# EAGLE design CommsBoard (EAGLE 7.2.0)
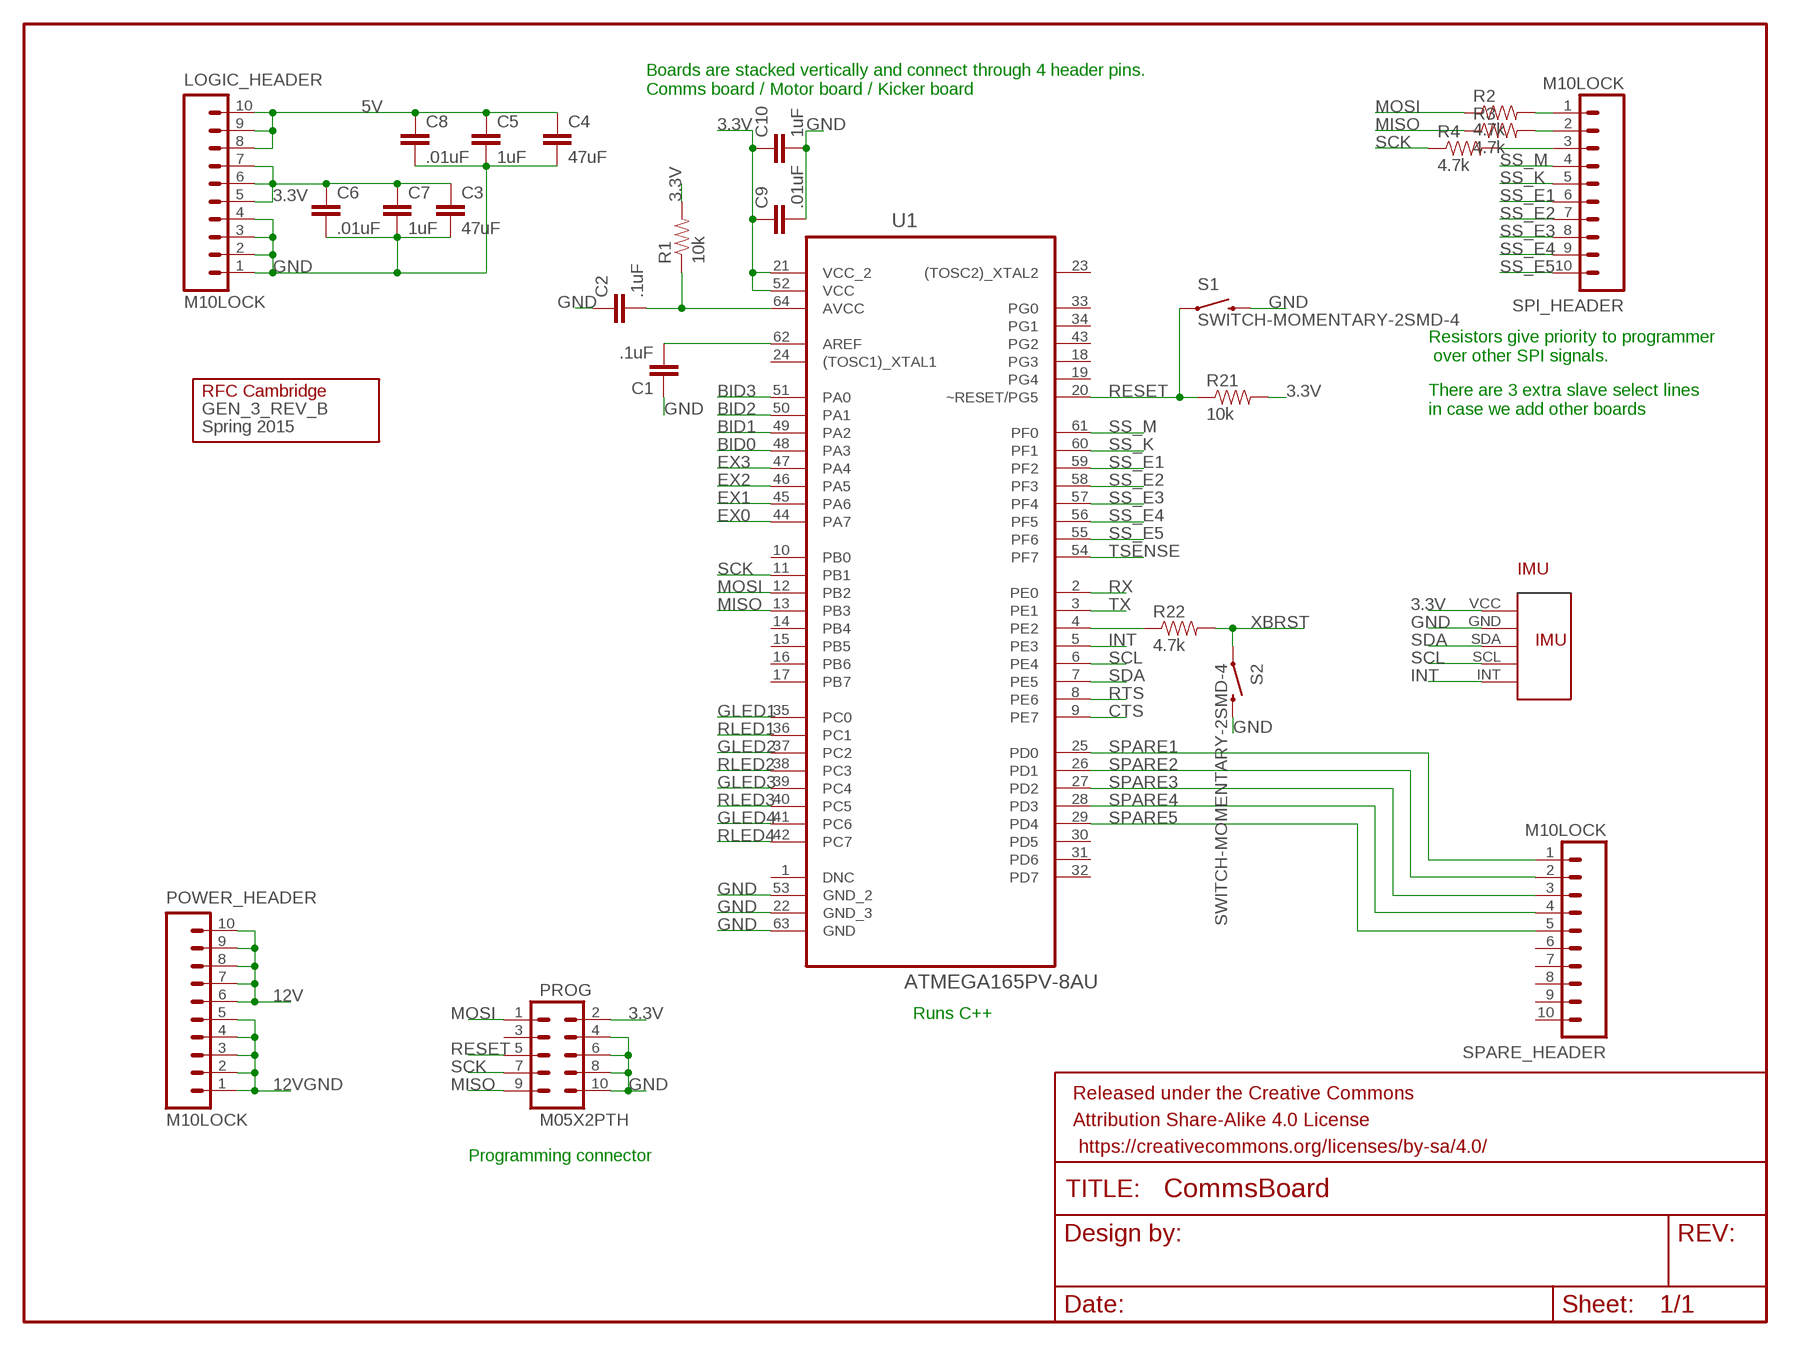
[diagram p0: schematic, sheet 1, part 1 of 2]
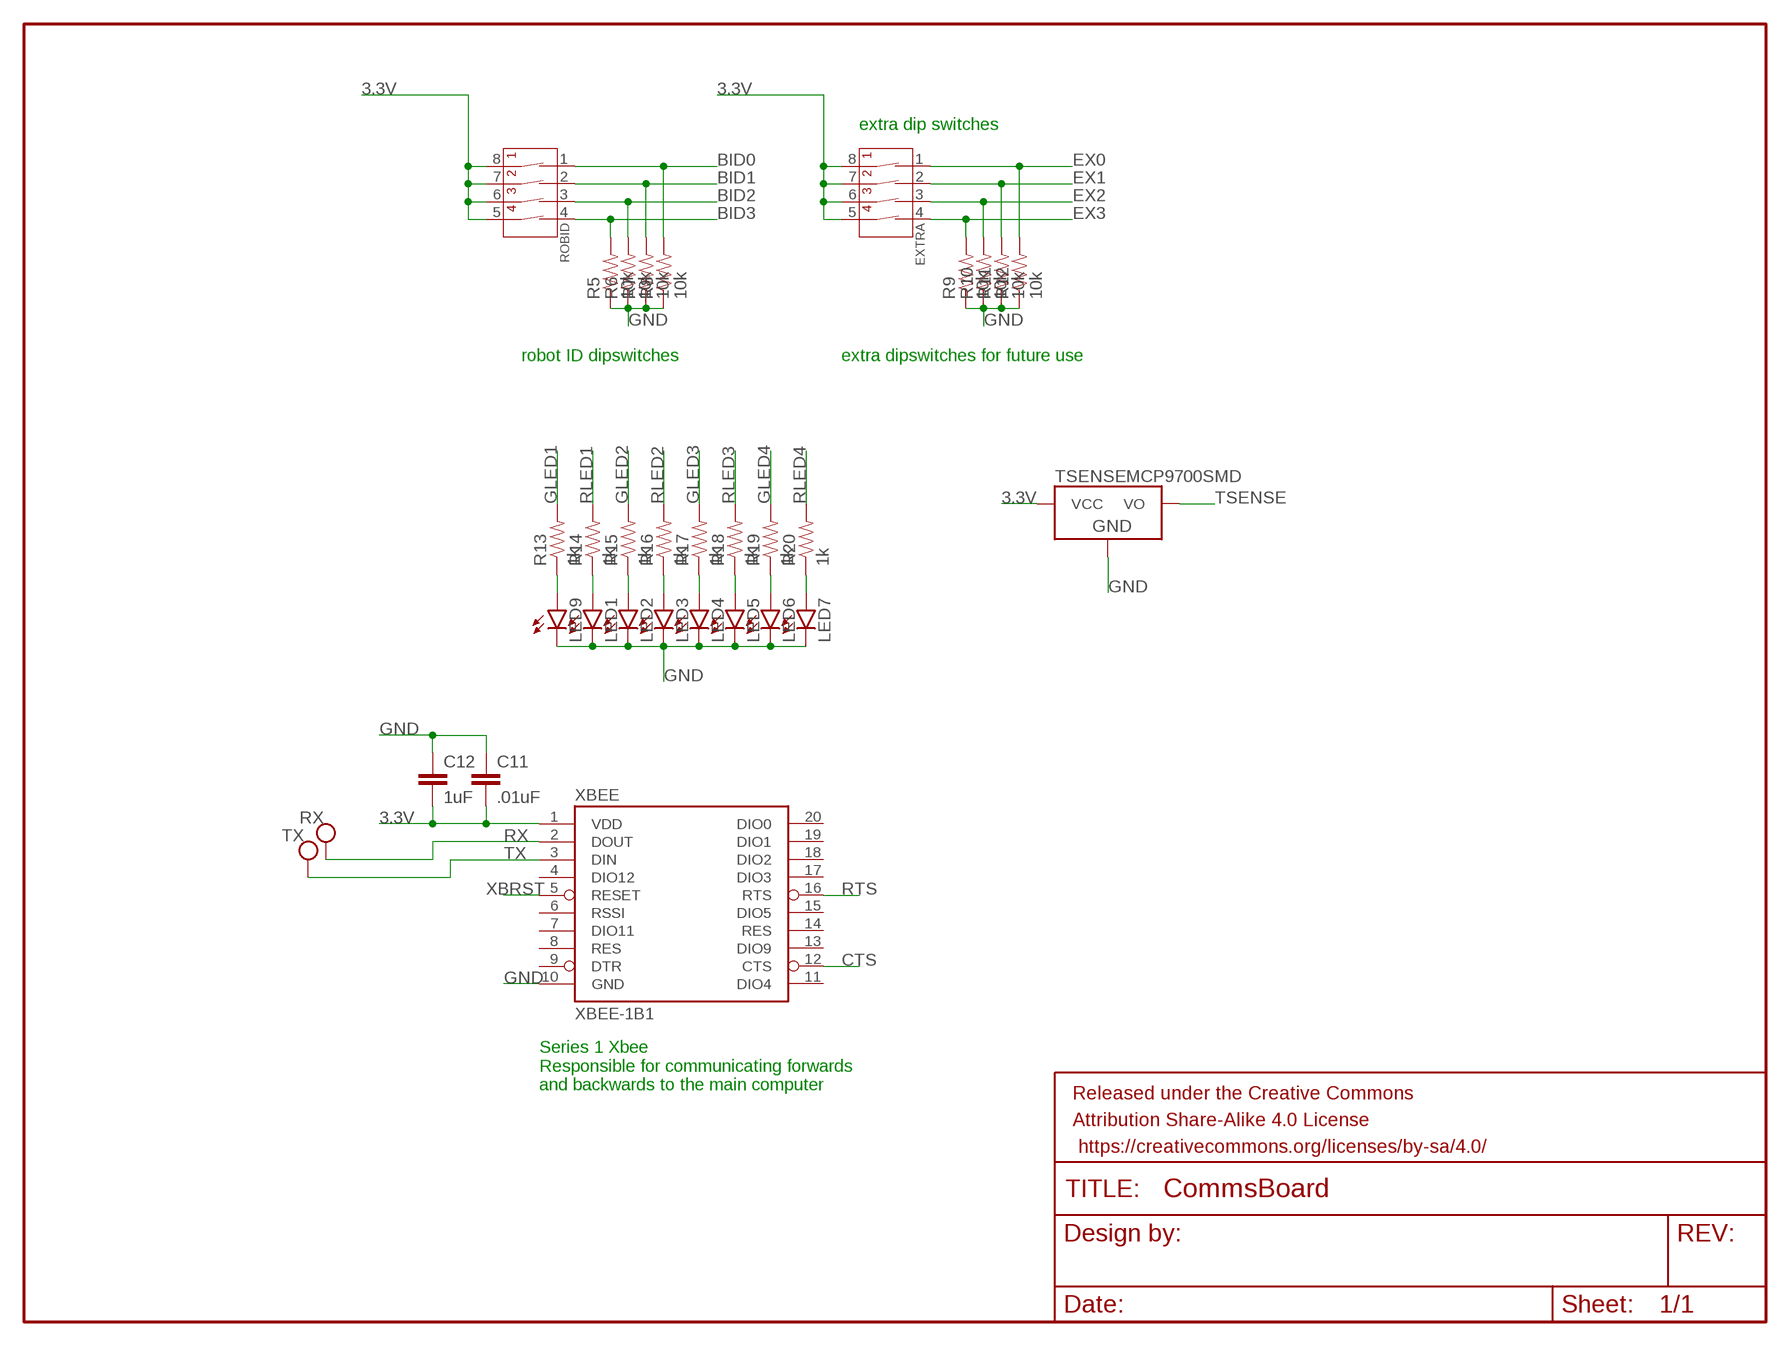
[diagram p1: schematic, sheet 1, part 2 of 2]

## Parts
C1  .1uF  CAP0805  [0805]
C2  .1uF  CAP0805  [0805]
C3  47uF  CAP1206  [1206]
C4  47uF  CAP1206  [1206]
C5  1uF  CAP0805  [0805]
C6  .01uF  CAP0805  [0805]
C7  1uF  CAP0805  [0805]
C8  .01uF  CAP0805  [0805]
C9  .01uF  CAP0805  [0805]
C10  1uF  CAP0805  [0805]
C11  .01uF  CAP0805  [0805]
C12  1uF  CAP0805  [0805]
EXTRA  4-POS-DIP  [4-POS-DIP-SMD]
FRAME1  FRAME-LETTER  [CREATIVE_COMMONS]
FRAME2  FRAME-LETTER  [CREATIVE_COMMONS]
GEN_3_REV_B  Spring 2015  LOGO  [LOGO]
IMU  MPU6050IMUMPU  [MPU-6050IMU]
LED1  LED1206  [LED-1206]
LED2  LED1206  [LED-1206]
LED3  LED1206  [LED-1206]
LED4  LED1206  [LED-1206]
LED5  LED1206  [LED-1206]
LED6  LED1206  [LED-1206]
LED7  LED1206  [LED-1206]
LED9  LED1206  [LED-1206]
LOGIC_HEADER  M10LOCK  [1X10_LOCK]
POWER_HEADER  M10LOCK  [1X10_LOCK]
PROG  M05X2PTH  [AVR_ICSP]
R1  10k  RESISTOR0805-RES  [0805]
R2  4.7k  RESISTOR0805-RES  [0805]
R3  4.7k  RESISTOR0805-RES  [0805]
R4  4.7k  RESISTOR0805-RES  [0805]
R5  10k  RESISTOR0805-RES  [0805]
R6  10k  RESISTOR0805-RES  [0805]
R7  10k  RESISTOR0805-RES  [0805]
R8  10k  RESISTOR0805-RES  [0805]
R9  10k  RESISTOR0805-RES  [0805]
R10  10k  RESISTOR0805-RES  [0805]
R11  10k  RESISTOR0805-RES  [0805]
R12  10k  RESISTOR0805-RES  [0805]
R13  1k  RESISTOR0805-RES  [0805]
R14  1k  RESISTOR0805-RES  [0805]
R15  1k  RESISTOR0805-RES  [0805]
R16  1k  RESISTOR0805-RES  [0805]
R17  1k  RESISTOR0805-RES  [0805]
R18  1k  RESISTOR0805-RES  [0805]
R19  1k  RESISTOR0805-RES  [0805]
R20  1k  RESISTOR0805-RES  [0805]
R21  10k  RESISTOR0805-RES  [0805]
R22  4.7k  RESISTOR0805-RES  [0805]
ROBID  4-POS-DIP  [4-POS-DIP-SMD]
RX  TEST_PT  [TESTING_PT]
S1  SWITCH-MOMENTARY-2SMD-4  [TACTILE_SWITCH_TALL]
S2  SWITCH-MOMENTARY-2SMD-4  [TACTILE_SWITCH_TALL]
SPARE_HEADER  M10LOCK  [1X10_LOCK]
SPI_HEADER  M10LOCK  [1X10_LOCK]
TSENSE  MCP9700SMD  [SOT23-3]
TX  TEST_PT  [TESTING_PT]
U1  ATMEGA165PV-8AU  [QFP80P1600X1600X120-64N]
XBEE  XBEE-1B1  [XBEE-1]

## Nets
3.3V: C3.1 C6.1 C7.1 C9.1 C10.1 C11.2 C12.2 EXTRA.5(4B) EXTRA.6(3B) EXTRA.7(2B) EXTRA.8(1B) IMU.VCC LOGIC_HEADER.5 LOGIC_HEADER.6 LOGIC_HEADER.7 PROG.2 R1.2 R21.2 ROBID.5(4B) ROBID.6(3B) ROBID.7(2B) ROBID.8(1B) TSENSE.1(VCC) U1.21(VCC_2) U1.52(VCC) XBEE.1(VDD)
5V: C4.1 C5.1 C8.1 LOGIC_HEADER.8 LOGIC_HEADER.9 LOGIC_HEADER.10
12V: POWER_HEADER.6 POWER_HEADER.7 POWER_HEADER.8 POWER_HEADER.9 POWER_HEADER.10
12VGND: POWER_HEADER.1 POWER_HEADER.2 POWER_HEADER.3 POWER_HEADER.4 POWER_HEADER.5
BID0: R8.2 ROBID.1(1A) U1.48(PA3)
BID1: R7.2 ROBID.2(2A) U1.49(PA2)
BID2: R6.2 ROBID.3(3A) U1.50(PA1)
BID3: R5.2 ROBID.4(4A) U1.51(PA0)
CTS: U1.9(PE7) XBEE.12(CTS)
EX0: EXTRA.1(1A) R12.2 U1.44(PA7)
EX1: EXTRA.2(2A) R11.2 U1.45(PA6)
EX2: EXTRA.3(3A) R10.2 U1.46(PA5)
EX3: EXTRA.4(4A) R9.2 U1.47(PA4)
FILT: C2.2 R1.1 U1.64(AVCC)
GLED1: R13.2 U1.35(PC0)
GLED2: R15.2 U1.37(PC2)
GLED3: R17.2 U1.39(PC4)
GLED4: R19.2 U1.41(PC6)
GND: C1.1 C2.1 C3.2 C4.2 C5.2 C6.2 C7.2 C8.2 C9.2 C10.2 C11.1 C12.1 IMU.GND LED1.C LED2.C LED3.C LED4.C LED5.C LED6.C LED7.C LED9.C LOGIC_HEADER.1 LOGIC_HEADER.2 LOGIC_HEADER.3 LOGIC_HEADER.4 PROG.4 PROG.6 PROG.8 PROG.10 R5.1 R6.1 R7.1 R8.1 R9.1 R10.1 R11.1 R12.1 S1.B2 S2.B2 TSENSE.3(GND) U1.22(GND_3) U1.53(GND_2) U1.63(GND) XBEE.10(GND)
INT: IMU.INT U1.5(PE3)
MISO: PROG.9 R3.1 U1.13(PB3)
MOSI: PROG.1 R2.1 U1.12(PB2)
N$1: LED9.A R13.1
N$2: R22.1 U1.4(PE2)
N$5: LED1.A R14.1
N$6: LED2.A R15.1
N$7: LED3.A R16.1
N$8: LED4.A R17.1
N$9: LED5.A R18.1
N$10: LED6.A R19.1
N$11: LED7.A R20.1
N$17: C1.2 U1.62(AREF)
PRE-MISO: R3.2 SPI_HEADER.2
PRE-MOSI: R2.2 SPI_HEADER.1
PRE-SCK: R4.2 SPI_HEADER.3
RESET: PROG.5 R21.1 S1.A2 U1.20(~RESET/PG5)
RLED1: R14.2 U1.36(PC1)
RLED2: R16.2 U1.38(PC3)
RLED3: R18.2 U1.40(PC5)
RLED4: R20.2 U1.42(PC7)
RTS: U1.8(PE6) XBEE.16(RTS)
RX: RX.P$1 U1.2(PE0) XBEE.2(DOUT)
SCK: PROG.7 R4.1 U1.11(PB1)
SCL: IMU.SCL U1.6(PE4)
SDA: IMU.SDA U1.7(PE5)
SPARE1: SPARE_HEADER.1 U1.25(PD0)
SPARE2: SPARE_HEADER.2 U1.26(PD1)
SPARE3: SPARE_HEADER.3 U1.27(PD2)
SPARE4: SPARE_HEADER.4 U1.28(PD3)
SPARE5: SPARE_HEADER.5 U1.29(PD4)
SS_E1: SPI_HEADER.6 U1.59(PF2)
SS_E2: SPI_HEADER.7 U1.58(PF3)
SS_E3: SPI_HEADER.8 U1.57(PF4)
SS_E4: SPI_HEADER.9 U1.56(PF5)
SS_E5: SPI_HEADER.10 U1.55(PF6)
SS_K: SPI_HEADER.5 U1.60(PF1)
SS_M: SPI_HEADER.4 U1.61(PF0)
TSENSE: TSENSE.2(VO) U1.54(PF7)
TX: TX.P$1 U1.3(PE1) XBEE.3(DIN)
XBRST: R22.2 S2.A2 XBEE.5(RESET)
Unconnected: PROG.3 SPARE_HEADER.6 SPARE_HEADER.7 SPARE_HEADER.8 SPARE_HEADER.9 SPARE_HEADER.10 U1.1(DNC) U1.10(PB0) U1.14(PB4) U1.15(PB5) U1.16(PB6) U1.17(PB7) U1.18(PG3) U1.19(PG4) U1.23((TOSC2)_XTAL2) U1.24((TOSC1)_XTAL1) U1.30(PD5) U1.31(PD6) U1.32(PD7) U1.33(PG0) U1.34(PG1) U1.43(PG2) XBEE.4(DIO12) XBEE.6(RSSI) XBEE.7(DIO11) XBEE.8(RES) XBEE.9(DTR) XBEE.11(DIO4) XBEE.13(DIO9) XBEE.14(RES) XBEE.15(DIO5) XBEE.17(DIO3) XBEE.18(DIO2) XBEE.19(DIO1) XBEE.20(DIO0)

## Notes on the sheet
- Boards are stacked vertically and connect through 4 header pins.
  Comms board / Motor board / Kicker board
- extra dip switches
- Resistors give priority to programmer
   over other SPI signals.
- robot ID dipswitches | extra dipswitches for future use
- There are 3 extra slave select lines
  in case we add other boards
- Runs C++
- Series 1 Xbee
  Responsible for communicating forwards
  and backwards to the main computer
- Programming connector

## Library data of the parts
C1-C12 = SparkFun-Capacitors:CAP: Capacitor Standard 0603 ceramic capacitor, and 0.1" leaded capacitor.
EXTRA ROBID = SparkFun-Electromechanical:4-POS-DIP: 4 Position DIP Switch CTS series 219; PROD_ID: SWCH-12418
FRAME1 FRAME2 = SparkFun-Aesthetics:FRAME-LETTER: Schematic Frame Standard 8.5x11 US Letter frame
GEN_3_REV_B = gen3:LOGO
IMU = gen3:MPU6050IMU: MPU6050 IMU
LED1-LED7 LED9 = SparkFun-LED:LED: LEDs Standard schematic elements and footprints for 5mm, 3mm, 1206, and 0603 sized LEDs. 5mm - Spark Fun Electronics SKU : COM-00529 (and others)
LOGIC_HEADER POWER_HEADER SPARE_HEADER SPI_HEADER = SparkFun-Connectors:M10: Header 10 Standard 10-pin 0.1" header. Use with straight break away headers (SKU : PRT-00116), right angle break away headers (PRT-00553), swiss pins (PRT-00743), machine pins (PRT-00117), and female headers (PRT-00115).
PROG = SparkFun-Connectors:M05X2: Header 5x2 Standard 10-pin dual row 0.1" header. Commonly used with AVR-ISP. Use with Spark Fun Electronics SKU: PRT-00778
R1-R22 = SparkFun-Passives:RESISTOR: Resistor Basic schematic elements and footprints for 0603, 1206, and PTH resistors.
RX TX = gen3:TEST_PT: Testing Point Use to probe a signal
S1 S2 = SparkFun-Electromechanical:SWITCH-MOMENTARY-2: Various NO switches- pushbuttons, reed, etc; PROD_ID: SWCH-11966
TSENSE = SparkFun-Sensors:MCP9700: Analog-output temperature sensor; PROD_ID: IC-08917
U1 = gen3:ATMEGA165PV-8AU: 8-bit Microcontroller with 16K Bytes In-System Programmable Flash; MPN: ATMEGA165PV-8AU; OC_FARNELL: 1455104; OC_NEWARK: 58M3730; PACKAGE: TQFP-64; SUPPLIER: Atmel
XBEE = SparkFun-RF:XBEE-1: Xbee module footprints SMT header is CONN-09042.

## Board
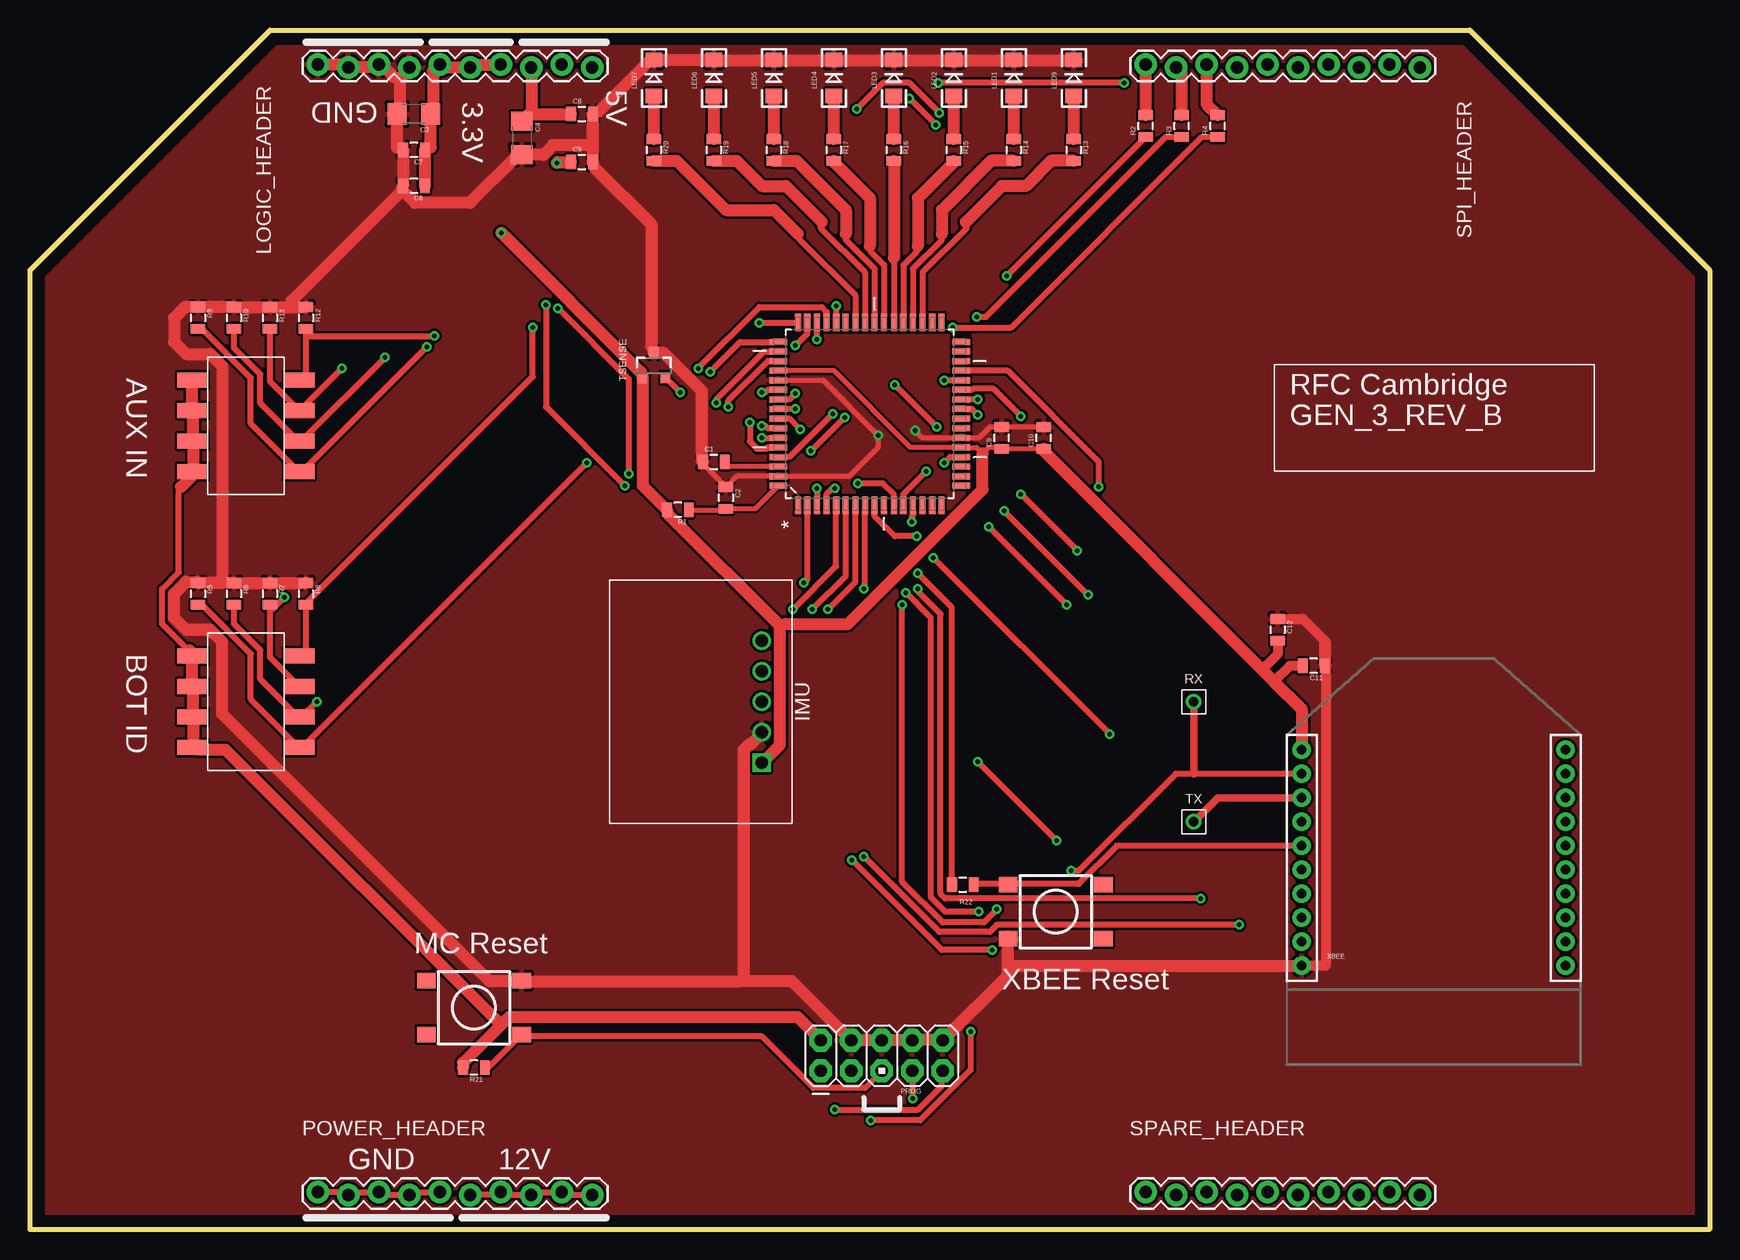
[diagram p2: board, top side]
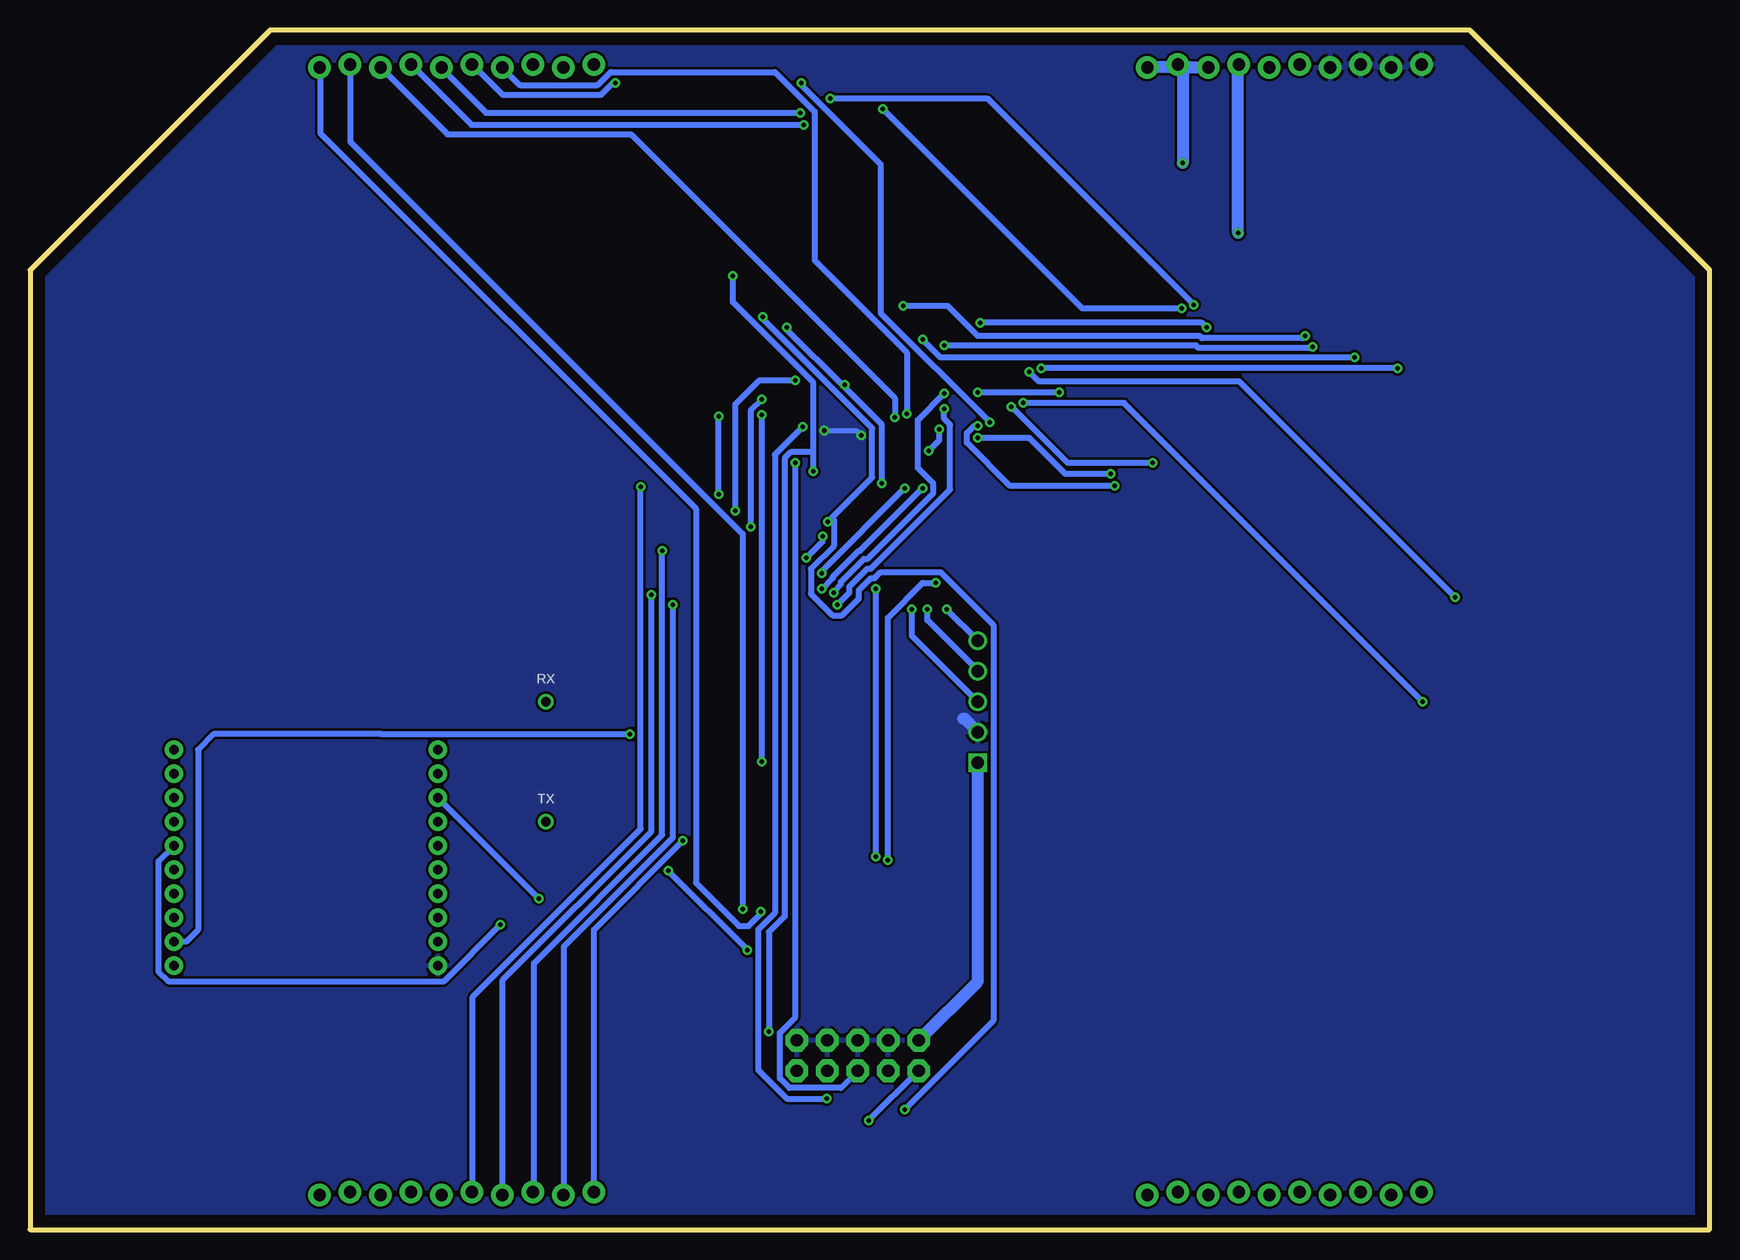
[diagram p3: board, bottom side, seen from below]

Size 140 x 100 mm. Coordinates in mm from the lower left corner, seen from the top.
Outline: 0,0 0,80 20,100 120,100 140,80 140,0 0,0
Copper layers (1*16): Top 0.035mm / dielectric 1.5mm / Bottom 0.035mm
Design rules "default *": minimum track width 10mil, minimum drill 15mil, track to track 8mil, track to pad 8mil, pad to pad 8mil, via to via 8mil, smd to smd 8mil, copper to edge 40mil, drill to drill 8mil, minimum pad ring 10mil, minimum via ring 8mil, stop-mask expansion 4mil, vias tented up to drill 0mil, thermal gap 10mil

### Footprints (pad centres in the part's own frame; a part is rotated, then mirrored left to right if it is on the bottom)
0805 = smd 0.8 x 1.2: 1 -0.9,0; 2 0.9,0
1206 = smd 1.6 x 1.8: 1 -1.4,0; 2 1.4,0
4-POS-DIP-SMD = smd 1.27 x 2.54: 1 -3.81,4.445; 2 -1.27,4.445; 3 1.27,4.445; 4 3.81,4.445; 5 3.81,-4.445; 6 1.27,-4.445; 7 -1.27,-4.445; 8 -3.81,-4.445
MPU-6050IMU = drill 1.016: GND 0,-2.54; INT 0,5.08; SCL 0,2.54; SDA 0,0 | drill 1.016 square: VCC 0,-5.08
LED-1206 = smd 1.2 x 1.4: A -1.5,0; C 1.5,0
1X10_LOCK = drill 1.016 pad 1.88: 1 0,0.127; 2 2.54,-0.127; 3 5.08,0.127; 4 7.62,-0.127; 5 10.16,0.127; 6 12.7,-0.127; 7 15.24,0.127; 8 17.78,-0.127; 9 20.32,0.127; 10 22.86,-0.127
AVR_ICSP = drill 1.016 pad 1.88 octagon: 1 -1.27,5.08; 2 1.27,5.08; 3 -1.27,2.54; 4 1.27,2.54; 5 -1.27,0; 6 1.27,0; 7 -1.27,-2.54; 8 1.27,-2.54; 9 -1.27,-5.08; 10 1.27,-5.08
TESTING_PT = drill 0.8: P$1 0,0
TACTILE_SWITCH_TALL = smd 1.55 x 1.3: A1 -3.975,-2.25; A2 3.975,-2.25; B1 -3.975,2.25; B2 3.975,2.25
SOT23-3 = smd 0.8 x 0.9: 1 -0.95,-1; 2 0.95,-1; 3 0,1.1
QFP80P1600X1600X120-64N = smd 1.473 x 0.508: 1 -7.62,5.994; 2 -7.62,5.207; 3 -7.62,4.394; 4 -7.62,3.607; 5 -7.62,2.794; 6 -7.62,2.007; 7 -7.62,1.194; 8 -7.62,0.406; 9 -7.62,-0.406; 10 -7.62,-1.194; 11 -7.62,-2.007; 12 -7.62,-2.794; 13 -7.62,-3.607; 14 -7.62,-4.394; 15 -7.62,-5.207; 16 -7.62,-5.994; 33 7.62,-5.994; 34 7.62,-5.207; 35 7.62,-4.394; 36 7.62,-3.607; 37 7.62,-2.794; 38 7.62,-2.007; 39 7.62,-1.194; 40 7.62,-0.406; 41 7.62,0.406; 42 7.62,1.194; 43 7.62,2.007; 44 7.62,2.794; 45 7.62,3.607; 46 7.62,4.394; 47 7.62,5.207; 48 7.62,5.994 | smd 0.508 x 1.473: 17 -5.994,-7.62; 18 -5.207,-7.62; 19 -4.394,-7.62; 20 -3.607,-7.62; 21 -2.794,-7.62; 22 -2.007,-7.62; 23 -1.194,-7.62; 24 -0.406,-7.62; 25 0.406,-7.62; 26 1.194,-7.62; 27 2.007,-7.62; 28 2.794,-7.62; 29 3.607,-7.62; 30 4.394,-7.62; 31 5.207,-7.62; 32 5.994,-7.62; 49 5.994,7.62; 50 5.207,7.62; 51 4.394,7.62; 52 3.607,7.62; 53 2.794,7.62; 54 2.007,7.62; 55 1.194,7.62; 56 0.406,7.62; 57 -0.406,7.62; 58 -1.194,7.62; 59 -2.007,7.62; 60 -2.794,7.62; 61 -3.607,7.62; 62 -4.394,7.62; 63 -5.207,7.62; 64 -5.994,7.62
XBEE-1 = drill 0.8 pad 1.524: 1 -11,20; 2 -11,18; 3 -11,16; 4 -11,14; 5 -11,12; 6 -11,10; 7 -11,8; 8 -11,6; 9 -11,4; 10 -11,2; 11 11,2; 12 11,4; 13 11,6; 14 11,8; 15 11,10; 16 11,12; 17 11,14; 18 11,16; 19 11,18; 20 11,20

### Placement (x,y rotation side)
C1  57,64 0 top
C2  58,61 270 top
C3  32,93 180 top
C4  41,91 270 top
C5  46,89 0 top
C6  32,87 180 top
C7  32,90 180 top
C8  46,93 0 top
C9  81,66 90 top
C10  84.5,66 90 top
C11  107,47 180 top
C12  104,50 270 top
EXTRA  18,67 270 top
FRAME1  21.59,-7.62 0 top  (outside the outline)
FRAME2  88.95,-14.47 0 top  (outside the outline)
GEN_3_REV_B  105,64.5 0 top
IMU  61,44 0 top
LED1  82,96 90 top
LED2  77,96 90 top
LED3  72,96 90 top
LED4  67,96 90 top
LED5  62,96 90 top
LED6  57,96 90 top
LED7  52,96 90 top
LED9  87,96 90 top
LOGIC_HEADER  24,97 0 top
POWER_HEADER  24,3 0 top
PROG  71,14.5 90 top
R1  54,60 180 top
R2  93,92 90 top
R3  96,92 90 top
R4  99,92 90 top
R5  14,53 270 top
R6  17,53 270 top
R7  20,53 270 top
R8  23,53 270 top
R9  14,76 270 top
R10  17,76 270 top
R11  20,76 270 top
R12  23,76 270 top
R13  87,90 270 top
R14  82,90 270 top
R15  77,90 270 top
R16  72,90 270 top
R17  67,90 270 top
R18  62,90 270 top
R19  57,90 270 top
R20  52,90 270 top
R21  37,13.5 180 top
R22  77.75,28.75 0 top
ROBID  18,44 270 top
RX  97,44 0 top
S1  37,18.5 0 top
S2  85.5,26.5 180 top
SPARE_HEADER  93,3 0 top
SPI_HEADER  93,97 0 top
TSENSE  52,72 0 top
TX  97,34 0 top
U1  70,68 90 top
XBEE  117,20 0 top

### Tracks (layer width: path | path; a pad name or v marks a point on that pad's centre or on a via)
3.3V  (via drill 0.38)
  Top 0.406: U1.52 67,71.6 73.39,65.21 U1.21 78.9,65.21 79.4,64.71 79.9,65.21 80.89,65.21 C9.1 C10.1
  Top 0.508: 12.6,61.9 12.4,61.4 12.4,54.8 11,53.4 11,50.5 12.9,48.6 13.3,48.3
  Top 0.813: C12.2 104,48 103,47 102.7,46.7 | C11.2 105,47 103.7,45.7
  Top 1.016: XBEE.1 106,43.4 103.7,45.7 102.7,46.7 84.5,64.9 C10.1 | EXTRA.8 13.5,70.8 13.5,68.8 EXTRA.7 13.6,68.2 13.6,66.2 EXTRA.6 13.6,65.7 13.6,63.2 EXTRA.5 13.4,62.7 12.6,61.9 | 13.3,48.3 ROBID.8 13.5,47.8 13.5,45.8 ROBID.7 13.6,45.2 13.6,43.2 ROBID.6 13.6,42.7 13.6,40.2 ROBID.5 14.1,40 16.3,40 39.25,17.05 | C6.1 C7.1 33.4,90.2 C3.1 33.6,93.5 33.6,96.6 34.1,97.1 LOGIC_HEADER.5 34.6,96.9 36.7,96.9 LOGIC_HEADER.6 37.2,97.1 39.2,97.1 LOGIC_HEADER.7 | 51.1,71 51.1,62 R1.2 53.3,59.5 62.5,50.3 | 51.1,71 TSENSE.1 | R21.2 36.1,13.9 39.25,17.05 | 39.25,17.05 39.9,17.7 64,17.7 65.9,15.8 PROG.2 | 62.5,50.3 62.5,40.4 61,38.9 IMU.VCC | v39.3,83.1 50.9,71.5 51.1,71 | 79.4,64.71 79.4,61.7 68.2,50.5 63,50.5 62.5,50.3
  Bottom 1.016: IMU.VCC 61,20.7 65.9,15.8 PROG.2 | v39.3,83.1 39.3,97.1 LOGIC_HEADER.7
5V  (via drill 0.38)
  Top 1.016: 41.8,93 41.6,93 C4.1 | 41.8,93 C8.1 | 41.8,93 41.8,96.8 LOGIC_HEADER.8 | C5.1 44,89 v43.9,88.9
  Bottom 1.016: v43.9,88.9 43.9,96.7 44.3,97.1 LOGIC_HEADER.9 | LOGIC_HEADER.10 46.8,96.9 44.8,96.9 LOGIC_HEADER.9 | LOGIC_HEADER.8 41.8,96.9 43.4,96.9 LOGIC_HEADER.9
12V
  Top 0.508: POWER_HEADER.6 36.7,2.9 39,2.9 39.2,3.1 POWER_HEADER.7 39.3,2.9 41.7,2.9 POWER_HEADER.8 41.9,3.1 44.3,3.1 POWER_HEADER.9 44.4,2.9 46.8,2.9 POWER_HEADER.10
12VGND
  Top 0.508: POWER_HEADER.1 24,3.1 26.3,3.1 26.5,2.9 POWER_HEADER.2 26.6,3.1 29,3.1 POWER_HEADER.3 29.2,2.9 31.6,2.9 POWER_HEADER.4 31.7,3.1 34.1,3.1 POWER_HEADER.5
BID0  (via drill 0.38)
  Top 0.508: ROBID.1 22.5,47.9 23,48.4 R8.2 23.1,52.3 41.9,71.1 v41.9,75.2 | v60.8,75.6 64,75.6 U1.48
  Bottom 0.508: v60.8,75.6 42.3,75.6 v41.9,75.2
BID1  (via drill 0.38)
  Top 0.508: 20,51.7 20,47.7 22.4,45.3 ROBID.2 | 20,51.7 R7.2 | v56.7,71.5 59.2,74 62.3,74 U1.49 | v21.2,52.7 20.2,51.7 20,51.7
  Bottom 0.508: v56.7,71.5 55.9,70.7 39.2,70.7 v21.2,52.7
BID2  (via drill 0.38)
  Top 0.508: R6.2 17,50.5 19.2,48.3 19.2,45.9 22.4,42.7 ROBID.3 22.7,42.8 v23.9,44 | v57.2,68.9 57.2,69.2 61.2,73.2 62.3,73.2 U1.50
  Bottom 0.508: v57.2,68.9 48.8,68.9 v23.9,44
BID3  (via drill 0.38)
  Top 0.508: R5.2 14.3,52.1 18.4,48 18.4,44.2 22.4,40.2 ROBID.4 22.7,40.2 v46.4,63.9 | v58.2,68.6 58.2,69.1 61.5,72.4 62.3,72.4 U1.51
  Bottom 0.508: v58.2,68.6 53.5,63.9 v46.4,63.9
CTS  (via drill 0.38)
  Top 0.508: v73.9,57.8 72.1,57.8 70.4,59.5 70.4,60.3 U1.9 | v90,41.3 v75.3,56
  Bottom 0.5: 110.7,41.3 124.7,41.3 126,40 126,25 127,24 XBEE.12
  Bottom 0.508: v73.9,57.8 73.9,57.4 v75.3,56 | 110.7,41.3 v90,41.3
EX0  (via drill 0.38)
  Top 0.508: 23,74.5 23,71.4 22.5,70.9 EXTRA.1 | 23,74.5 R12.2 | v67.2,77 67.2,75.7 U1.44 | 23,74.5 v33.7,74.5
  Bottom 0.508: v67.2,77 63.5,77 61,74.5 42.5,74.5 42.3,74.3 33.9,74.3 v33.7,74.5
EX1  (via drill 0.38)
  Top 0.508: R11.2 20,70.7 22.4,68.3 EXTRA.2 22.6,68.4 v26,71.8 | v55.7,71.8 60.8,76.9 66,76.9 66.4,76.5 66.4,75.7 U1.45
  Bottom 0.508: v26,71.8 v55.7,71.8
EX2  (via drill 0.38)
  Top 0.508: R10.2 17,73.5 19.2,71.3 19.2,68.9 22.4,65.7 EXTRA.3 22.7,65.8 v29.6,72.7 | v65.6,74.2 65.6,75.6 U1.46
  Bottom 0.508: v65.6,74.2 64.1,72.7 v29.6,72.7
EX3  (via drill 0.38)
  Top 0.508: R9.2 14.3,75.1 18.4,71 18.4,67.2 22.4,63.2 EXTRA.4 22.7,63.2 v33.1,73.6 | v63.8,73.7 64.8,74.7 64.8,75.6 U1.47
  Bottom 0.508: v63.8,73.7 42.8,73.7 42.6,73.5 33.2,73.5 v33.1,73.6
FILT
  Top 0.4: U1.64 60.47,60.1 C2.2 57.9,60 R1.1
GLED1
  Top 0.508: U1.35 74.4,75.7 74.4,79.8 78.1,83.5 78,84
  Top 1.016: R13.2 85.1,89.1 83,87 81,87 78,84
GLED2
  Top 0.508: U1.37 72.8,75.7 72.8,80.4 73.9,81.5 74,82
  Top 1.016: R15.2 77,89 74,86 74,82
GLED3
  Top 0.508: U1.39 71.2,75.7 71.2,80.4 70.1,81.5 70,82
  Top 1.016: R17.2 67,89 70,86 70,82
GLED4
  Top 0.508: U1.41 69.6,75.7 69.6,79.8 65.9,83.5 66,84
  Top 1.016: R19.2 58.9,89.1 61,87 63,87 66,84
GND  (via drill 0.4)
  Top 0.4: 68.29,62.79 70.7,65.2 v70.7,66.2 66.11,70.79 U1.53 | U1.63 58.89,62.79 C2.1 56.1,63.8 C1.1
  Top 0.406: C10.2 C9.2 80,66.9 79.1,66 U1.22 | U1.22 | U1.63 68.29,62.79 | U1.22 74.4,66 v73.8,66.6
  Top 0.813: C12.1 106.1,50.9 108,49 | 108,49 108,47.1 | 108,47.1 C11.1 107.9,48.9 108,49 | 108,47.1 108,22 XBEE.10
  Top 1.016: 81.5,22 81.5,21.2 76.1,15.8 PROG.10 75.6,15.8 73.6,15.8 PROG.8 73.1,15.8 71.5,15.8 PROG.6 71,15.8 68.9,15.8 PROG.4 68.4,15.8 63.5,20.7 59.5,20.7 59.5,21 | 81.5,22 81.5,24.2 S2.B2 | 81.5,22 XBEE.10 | 41,20.7 S1.B2 | 59.5,21 59.5,40 59.9,40.4 60,40.4 61,41.4 IMU.GND | LOGIC_HEADER.1 24,97.1 26.1,97.1 LOGIC_HEADER.2 26.6,96.9 28.8,96.9 29,97.1 LOGIC_HEADER.3 29.5,96.9 30.3,96.1 30.8,96 | 30.8,96 30.8,93.5 C3.2 30.6,90.2 C7.2 C6.2 30.9,86.5 | 30.8,96 31.6,96.8 LOGIC_HEADER.4 | 16,53.9 R6.1 R7.1 R8.1 | 16,53.9 R5.1 13.9,54 13,54 12,53 12,51 13,50 15,50 16,49 16,43 38.3,20.7 41,20.7 | 21.8,76.9 R11.1 R10.1 R9.1 12.9,76.9 12,76 12,74 13,73 15,73 16,72 16,53.9 | 21.8,76.9 R12.1 | 30.9,86.5 21.8,77.4 21.8,76.9 | C1.1 56,64.1 56,69.9 52.8,73.1 TSENSE.3 51.8,73.6 51.8,83.8 47.1,88.5 C5.2 46.9,90.4 | 46.9,90.4 C8.2 47.4,93.2 51.5,97.3 LED7.C LED6.C LED5.C LED4.C LED3.C LED2.C LED1.C LED9.C | 46.9,90.4 43.6,90.4 42.8,89.6 C4.2 40.5,89.4 36.7,85.6 32.1,85.6 31.4,86.3 30.9,86.5 | 41,20.7 59.2,20.7 59.5,21
  Bottom 0.406: v73.8,66.6 71.1,66.6 v70.7,66.2
  Bottom 1.016: 62.2,42.6 62.1,42.6 61,41.5 IMU.GND
  pour Bottom: 21,99 1,79 1,1 139,1 139,79 119,99
  pour Top: 21,99 1,79 1,1 139,1 139,79 119,99
INT  (via drill 0.38)
  Top 0.508: v63.6,51.7 67.2,55.3 67.2,60.3 U1.5
  Bottom 0.508: v63.6,51.7 61,49.1 IMU.INT
MISO  (via drill 0.38)
  Top 0.508: R3.1 94.7,91.1 79.7,76.1 v78.9,76.1 | v73.5,59 73.5,59.4 73.6,59.5 73.6,60.3 U1.13 | v67.1,10 74,10 76,12 76,13.2 PROG.9
  Bottom 0.508: v78.9,76.1 78.9,75.9 69.8,66.8 69.8,62.7 73.15,59.35 | v73.5,59 73.15,59.35 | v67.1,10 59.7,17.4 59.7,50.4 64.1,54.8 69.1,54.8 69.6,54.3 69.9,54.3 70.9,53.3 70.9,52.6 72.3,51.2 73.1,51.2 74.9,53 74.9,55.1 73,57 73,59.2 73.15,59.35
MOSI  (via drill 0.38)
  Top 0.508: v81.4,79.5 R2.1 | v74.7,63.2 72.8,61.3 72.8,60.4 U1.12 | v70.1,9.1 74.2,9.1 78.4,13.3 v78.4,16.5
  Bottom 0.508: v81.4,79.5 81.4,77.3 74.7,70.6 74.7,64.8 | v74.7,63.2 74.7,64.8 | v70.1,9.1 66,13.2 PROG.1 | v78.4,16.5 78.4,24.8 77.1,26.1 77.1,64.3 76.6,64.8 74.7,64.8
N$1
  Top 1.016: R13.1 LED9.A
N$2  (via drill 0.38)
  Top 0.508: v74,54.7 76.8,51.9 76.8,28.8 R22.1 | v67.1,61.8 66.9,61.8 66.4,61.3 66.4,60.4 U1.4
  Bottom 0.508: v74,54.7 74,54.9 v67.1,61.8
N$5
  Top 1.016: R14.1 LED1.A
N$6
  Top 1.016: R15.1 LED2.A
N$7
  Top 1.016: R16.1 LED3.A
N$8
  Top 1.016: R17.1 LED4.A
N$9
  Top 1.016: R18.1 LED5.A
N$10
  Top 1.016: R19.1 LED6.A
N$11
  Top 1.016: R20.1 LED7.A
N$17
  Top 0.4: U1.62 58.29,63.61 C1.2
PRE-MISO
  Top 1.016: R3.2 96,96.41 SPI_HEADER.2
PRE-MOSI
  Top 1.016: R2.2 SPI_HEADER.1
PRE-SCK
  Top 1.016: SPI_HEADER.3 98.08,93.82 R4.2
RESET  (via drill 0.38)
  Top 0.508: R21.1 38.2,13.5 40.9,16.2 S1.A2 41.2,16.1 61,16.1 65.3,11.8 69.6,11.8 71,13.2 PROG.5 | v76.2,63.9 76.7,64.4 77.6,64.4 U1.20
  Bottom 0.508: v76.2,63.9 76.2,17.7 77.5,16.4 77.5,12.6 76.7,11.8 72.4,11.8 71,13.2 PROG.5
RLED1
  Top 0.508: U1.36 73.6,75.7 73.6,80.1 76,82.5 76,83
  Top 1.016: R14.2 80.1,89.1 76,85 76,83
RLED2
  Top 0.508: 72,81 72,75.7 U1.38
  Top 1.016: R16.2 72,81
RLED3
  Top 0.508: U1.40 70.4,75.7 70.4,80.1 68,82.5 68,83
  Top 1.016: R18.2 63.9,89.1 68,85 68,83
RLED4
  Top 0.508: U1.42 68.8,75.7 68.8,77.9 64.2,82.5 64,83
  Top 1.016: R20.2 53.9,89.1 58,85 62,85 64,83
RTS  (via drill 0.38)
  Top 0.508: v69.5,53.4 69.6,53.5 69.6,60.3 U1.8 | v69.5,31.1 75.8,24.8 80,24.8 80.6,25.4 v100.8,25.4
  Bottom 0.508: v69.5,31.1 v69.5,53.4 | v100.8,25.4 105.5,20.7 128.5,20.7 129.3,21.5 129.3,30.7 XBEE.16
RX  (via drill 0.38)
  Top 0.508: v64.5,53.9 64.8,54.2 64.8,60.3 U1.2 | v68.5,30.8 76,23.3 v80.2,23.3 | v86.8,29.9 87.4,29.9 95.5,38 97,38 XBEE.2
  Top 0.61: RX.P$1 97,38
  Bottom 0.508: v64.5,53.9 65.6,53.9 68.5,51 v68.5,30.8 | v86.8,29.9 v80.2,23.3
SCK  (via drill 0.38)
  Top 0.508: R4.1 97.7,91.1 81.8,75.2 v76.9,75.2 | v69,62.2 71.1,62.2 72,61.3 72,60.4 U1.11 | v73.6,10.9 73.6,13.2 PROG.7 | v72.1,70.4 v75.6,66.9
  Bottom 0.508: v76.9,75.2 76.9,75 72.2,70.3 | 72.2,70.3 69,67.1 v69,62.2 | v73.6,10.9 76.9,10.9 79.3,13.3 79.3,25 77.9,26.4 77.9,64.6 v75.6,66.9 | v72.1,70.4 72.2,70.3
SCL  (via drill 0.38)
  Top 0.508: v65.2,51.7 68,54.5 68,60.3 U1.6
  Bottom 0.508: v65.2,51.7 65.2,50.8 61,46.6 IMU.SCL
SDA  (via drill 0.38)
  Top 0.508: v66.5,51.7 68.8,54 68.8,60.3 U1.7
  Bottom 0.508: v66.5,51.7 66.5,49.5 IMU.SDA
SPARE1  (via drill 0.38)
  Top 0.508: v79,67.9 78.5,68.4 77.7,68.4 U1.25 | v85.6,32.4 v79,39
  Bottom 0.508: v79,39 v79,67.9 | v85.6,32.4 93,25 SPARE_HEADER.1
SPARE2  (via drill 0.38)
  Top 0.508: v79,69.2 77.7,69.2 U1.26 | v86.4,52.1 v79.9,58.6
  Bottom 0.508: v79,69.2 79.9,68.3 v79.9,58.6 | v86.4,52.1 86.4,32.7 95.5,23.6 95.5,2.9 SPARE_HEADER.2
SPARE3  (via drill 0.38)
  Top 0.508: v82.6,67.8 80.3,70.1 78.6,70.1 78.5,70 77.7,70 U1.27 | v87.3,56.6 v82.6,61.3
  Bottom 0.508: v82.6,61.3 v82.6,67.8 | v87.3,56.6 87.3,32.9 98,22.2 98,3.2 SPARE_HEADER.3
SPARE4  (via drill 0.38)
  Top 0.508: v76.2,70.8 77.6,70.8 U1.28 | v88.2,52.9 v81.2,59.9
  Bottom 0.508: v76.2,70.8 79.2,70.8 81.2,68.8 v81.2,59.9 | v88.2,52.9 88.2,33.2 100.6,20.8 100.6,2.9 SPARE_HEADER.4
SPARE5  (via drill 0.38)
  Top 0.508: v89.1,61.9 89.1,64 81.5,71.6 77.7,71.6 U1.29
  Bottom 0.508: v89.1,61.9 89.1,33.4 103.1,19.4 103.1,3.2 SPARE_HEADER.5
SS_E1  (via drill 0.38)
  Top 0.508: v61,66 62.3,66 U1.59 | v49.9,63 49.9,70.9 v44,76.8 | v68.9,93.4 71.1,95.6 73.3,95.6 v75.8,93.1
  Bottom 0.508: v61,66 56.7,66 53.7,63 v49.9,63 | v44,76.8 52.3,76.8 v68.9,93.4 | v75.8,93.1 102,93.1 105.7,96.8 SPI_HEADER.6
SS_E2  (via drill 0.38)
  Top 0.508: v61,67 61.3,67 61.5,66.8 62.3,66.8 U1.58 | v49.6,62 43,68.6 v43,77.1 | v75.5,92.1 v73.3,94.3
  Bottom 0.508: v61,67 61.3,67 61.9,66.4 61.9,65.6 58.3,62 v49.6,62 | v43,77.1 60.2,94.3 v73.3,94.3 | v75.5,92.1 103.2,92.1 108.2,97.1 SPI_HEADER.7
SS_E3  (via drill 0.38)
  Top 0.508: v64.2,66.7 63.3,67.6 62.4,67.6 U1.57 | v67.9,67.7 v65.1,64.9
  Bottom 0.508: v64.2,66.7 64.2,65.8 v65.1,64.9 | v67.9,67.7 67.9,69.3 89.9,91.3 105.2,91.3 110.7,96.8 SPI_HEADER.8
SS_E4  (via drill 0.38)
  Top 0.508: v63.8,68.4 62.4,68.4 U1.56 | v72.7,52.1 72.7,29 76.1,25.6 79.5,25.6 v80.6,26.7
  Bottom 0.508: v63.8,68.4 63.8,67.6 63.3,67.1 63.3,61.7 69.9,55.1 70.2,55.1 71.7,53.6 71.7,53.1 v72.7,52.1 | v80.6,26.7 80.6,58 113.3,90.7 113.3,97.1 SPI_HEADER.9
SS_E5  (via drill 0.38)
  Top 0.508: v63.8,69.7 63.3,69.2 62.4,69.2 U1.55 | v73,53.1 75.1,51 75.1,27.7 76.3,26.5 v79.1,26.5
  Bottom 0.508: v63.8,69.7 66,67.5 66,63.5 64.7,62.2 64.7,61.4 70.2,55.9 70.5,55.9 72.4,54 72.4,53.8 73,53.2 v73,53.1 | v79.1,26.5 79.1,26.3 80.1,25.3 80.9,25.3 84.5,28.9 84.5,60.1 115.8,91.4 115.8,96.8 SPI_HEADER.10
SS_K  (via drill 0.38)
  Top 0.508: v60,67.3 60,65.7 60.6,65.1 61.4,65.1 61.5,65.2 62.3,65.2 U1.60 | v91.2,95.6 v75.7,95.6
  Bottom 0.508: v60,67.3 69.1,76.4 69.1,88.8 75.7,95.4 v75.7,95.6 | v91.2,95.6 91.4,95.6 92.4,94.6 100.6,94.6 103.1,97.1 SPI_HEADER.5
SS_M  (via drill 0.38)
  Top 0.508: v66.9,68 63.3,64.4 62.4,64.4 U1.61
  Bottom 0.508: v66.9,68 66.9,73.1 74.6,80.8 74.6,93.2 77.9,96.5 91.6,96.5 92.7,95.4 99.2,95.4 100.6,96.8 SPI_HEADER.4
TSENSE  (via drill 0.38)
  Top 0.508: v54.2,69.8 53,71 TSENSE.2 | v61,69.8 61.3,69.8 61.5,70 62.3,70 U1.54
  Bottom 0.508: v61,69.8 v54.2,69.8
TX  (via drill 0.38)
  Top 0.508: v65.6,61.8 65.6,60.4 U1.3 | v74,53.4 74,53.2 75.9,51.3 75.9,28 76.3,27.6 v97.6,27.6
  Top 0.61: XBEE.3 99,36 TX.P$1
  Bottom 0.508: v65.6,61.8 70.8,56.6 70.9,56.6 73.1,54.4 73.1,54.3 v74,53.4 | XBEE.3 v97.6,27.6
XBRST
  Top 0.508: R22.2 78.7,28.8 81.5,28.8 S2.A2 81.7,28.8 87.4,28.8 90.6,32 XBEE.5

### Text on the board
tPlace: 5V | GND | 3.3V | AUX IN | BOT ID | MC Reset | XBEE Reset | GND | 12V